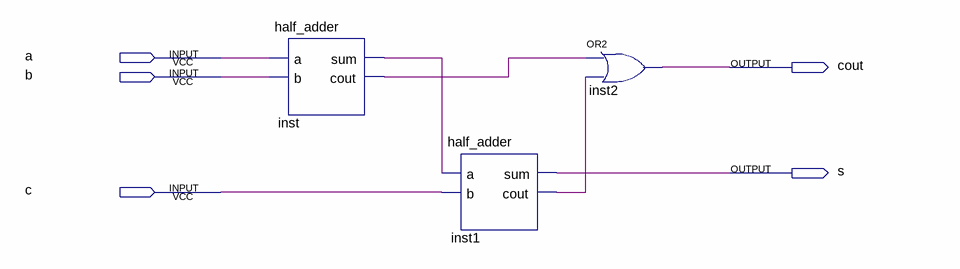
[diagram p0: schematic sheet]
// Quartus schematic full_adder.bdf as structural Verilog: 3 symbols, 5 pins
module full_adder (
  input  a,
  input  b,
  input  c,
  output cout,
  output s
);

  wire inst1_cout, inst_cout, inst_sum;

  half_adder inst (.a(a), .b(b), .sum(inst_sum), .cout(inst_cout));
  half_adder inst1 (.a(inst_sum), .b(c), .sum(s), .cout(inst1_cout));
  or inst2 (cout, inst_cout, inst1_cout);
endmodule
